# EAGLE schematic 7Seg6digit (EAGLE 7.2.0)
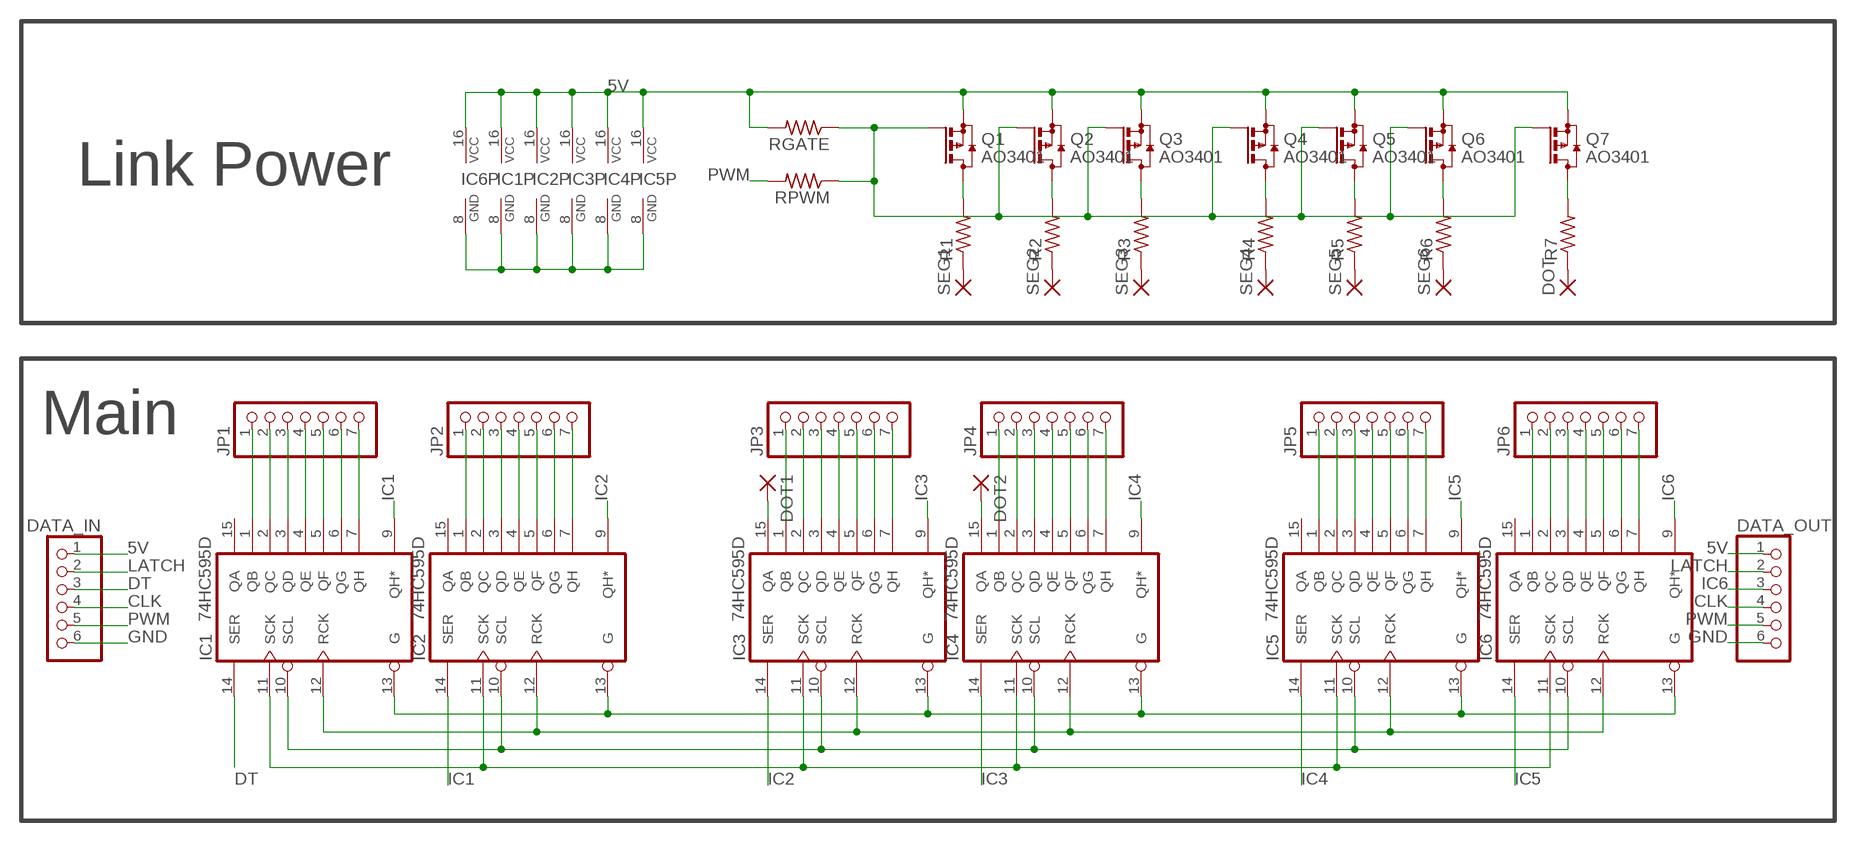
[diagram p0: schematic, sheet 1]

## Parts
DATA_IN  PINHD-1X6  [1X06]
DATA_OUT  PINHD-1X6  [1X06]
DOT  SMD2  [SMD1,27-2,54]
DOT1  SMD2  [SMD1,27-2,54]
DOT2  SMD2  [SMD1,27-2,54]
IC1  74HC595D  [SO16]
IC2  74HC595D  [SO16]
IC3  74HC595D  [SO16]
IC4  74HC595D  [SO16]
IC5  74HC595D  [SO16]
IC6  74HC595D  [SO16]
JP1  PINHD-1X7  [1X07]
JP2  PINHD-1X7  [1X07]
JP3  PINHD-1X7  [1X07]
JP4  PINHD-1X7  [1X07]
JP5  PINHD-1X7  [1X07]
JP6  PINHD-1X7  [1X07]
Q1  AO3401  BSS84  [SOT23]
Q2  AO3401  BSS84  [SOT23]
Q3  AO3401  BSS84  [SOT23]
Q4  AO3401  BSS84  [SOT23]
Q5  AO3401  BSS84  [SOT23]
Q6  AO3401  BSS84  [SOT23]
Q7  AO3401  BSS84  [SOT23]
R1  R-US_M1206  [M1206]
R2  R-US_M1206  [M1206]
R3  R-US_M1206  [M1206]
R4  R-US_M1206  [M1206]
R5  R-US_M1206  [M1206]
R6  R-US_M1206  [M1206]
R7  R-US_M1206  [M1206]
RGATE  R-US_M1206  [M1206]
RPWM  R-US_M1206  [M1206]
SEG1  SMD2  [SMD1,27-2,54]
SEG2  SMD2  [SMD1,27-2,54]
SEG3  SMD2  [SMD1,27-2,54]
SEG4  SMD2  [SMD1,27-2,54]
SEG5  SMD2  [SMD1,27-2,54]
SEG6  SMD2  [SMD1,27-2,54]

## Nets
5V: DATA_IN.1 DATA_OUT.1 IC1.10(SCL) IC1.16(VCC) IC2.10(SCL) IC2.16(VCC) IC3.10(SCL) IC3.16(VCC) IC4.10(SCL) IC4.16(VCC) IC5.10(SCL) IC5.16(VCC) IC6.10(SCL) IC6.16(VCC) Q1.2(S) Q2.2(S) Q3.2(S) Q4.2(S) Q5.2(S) Q6.2(S) Q7.2(S) RGATE.2
CLK: DATA_IN.4 DATA_OUT.4 IC1.11(SCK) IC2.11(SCK) IC3.11(SCK) IC4.11(SCK) IC5.11(SCK) IC6.11(SCK)
DT: DATA_IN.3 IC1.14(SER)
GND: DATA_IN.6 DATA_OUT.6 IC1.8(GND) IC1.13(G) IC2.8(GND) IC2.13(G) IC3.8(GND) IC3.13(G) IC4.8(GND) IC4.13(G) IC5.8(GND) IC5.13(G) IC6.8(GND) IC6.13(G)
IC1: IC1.9(QH*) IC2.14(SER)
IC2: IC2.9(QH*) IC3.14(SER)
IC3: IC3.9(QH*) IC4.14(SER)
IC4: IC4.9(QH*) IC5.14(SER)
IC5: IC5.9(QH*) IC6.14(SER)
IC6: DATA_OUT.3 IC6.9(QH*)
LATCH: DATA_IN.2 DATA_OUT.2 IC1.12(RCK) IC2.12(RCK) IC3.12(RCK) IC4.12(RCK) IC5.12(RCK) IC6.12(RCK)
N$1: IC1.6(QG) JP1.6
N$2: IC1.4(QE) JP1.4
N$3: IC1.2(QC) JP1.2
N$4: IC1.1(QB) JP1.1
N$5: IC1.3(QD) JP1.3
N$6: IC1.5(QF) JP1.5
N$7: IC1.7(QH) JP1.7
N$8: IC2.6(QG) JP2.6
N$9: IC2.4(QE) JP2.4
N$10: IC2.2(QC) JP2.2
N$11: IC2.1(QB) JP2.1
N$12: IC2.3(QD) JP2.3
N$13: IC2.5(QF) JP2.5
N$14: IC2.7(QH) JP2.7
N$15: IC6.6(QG) JP6.6
N$16: IC6.4(QE) JP6.4
N$17: IC6.2(QC) JP6.2
N$18: IC6.1(QB) JP6.1
N$19: IC6.3(QD) JP6.3
N$20: IC6.5(QF) JP6.5
N$21: IC6.7(QH) JP6.7
N$22: IC5.6(QG) JP5.6
N$23: IC5.4(QE) JP5.4
N$24: IC5.2(QC) JP5.2
N$25: IC5.1(QB) JP5.1
N$26: IC5.3(QD) JP5.3
N$27: IC5.5(QF) JP5.5
N$28: IC5.7(QH) JP5.7
N$29: IC4.6(QG) JP4.6
N$30: IC4.4(QE) JP4.4
N$31: IC4.2(QC) JP4.2
N$32: R1.1 SEG1.1(P)
N$33: R2.1 SEG2.1(P)
N$34: R3.1 SEG3.1(P)
N$35: R4.1 SEG4.1(P)
N$36: IC4.1(QB) JP4.1
N$37: IC4.3(QD) JP4.3
N$38: IC4.5(QF) JP4.5
N$39: IC4.7(QH) JP4.7
N$40: IC3.6(QG) JP3.6
N$41: IC3.4(QE) JP3.4
N$42: IC3.2(QC) JP3.2
N$43: IC3.1(QB) JP3.1
N$44: IC3.3(QD) JP3.3
N$45: IC3.5(QF) JP3.5
N$46: IC3.7(QH) JP3.7
N$47: R5.1 SEG5.1(P)
N$48: R6.1 SEG6.1(P)
N$50: Q1.3(D) R1.2
N$51: Q2.3(D) R2.2
N$52: Q3.3(D) R3.2
N$53: Q4.3(D) R4.2
N$54: Q5.3(D) R5.2
N$55: Q6.3(D) R6.2
N$56: DOT1.1(P) IC3.15(QA)
N$57: DOT.1(P) R7.1
N$58: Q7.3(D) R7.2
N$59: DOT2.1(P) IC4.15(QA)
PWM: DATA_IN.5 DATA_OUT.5 RPWM.2
SIGPWM: Q1.1(G) Q2.1(G) Q3.1(G) Q4.1(G) Q5.1(G) Q6.1(G) Q7.1(G) RGATE.1 RPWM.1
Unconnected: IC1.15(QA) IC2.15(QA) IC5.15(QA) IC6.15(QA)

## Notes on the sheet
- Link Power
- Main

## Library data of the parts
DATA_IN DATA_OUT = pinhead:PINHD-1X6: PIN HEADER
DOT DOT1 DOT2 SEG1-SEG6 = wirepad:SMD2: SMD PAD
IC1-IC6 = 74xx-eu:74*595: 8-bit SHIFT REGISTER, output latch
JP1-JP6 = pinhead:PINHD-1X7: PIN HEADER
Q1-Q7 = transistor-small-signal:BSS84: P-CHANNEL MOS FET
R1-R7 RGATE RPWM = rcl:R-US_: RESISTOR, American symbol